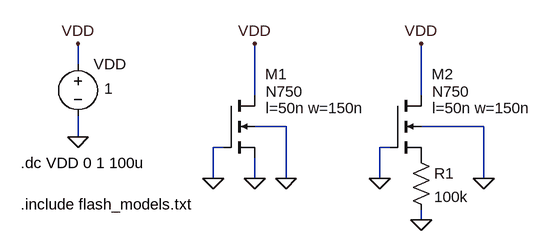
[diagram p0: schematic Flash_cells_parasitic_R.asc]
Flash_cells_parasitic_R.asc, the LTspice schematic file:
Version 4
SHEET 1 2620 680
WIRE 432 -1520 432 -1552
WIRE 704 -1472 704 -1552
WIRE 960 -1472 960 -1552
WIRE 752 -1424 704 -1424
WIRE 1056 -1424 960 -1424
WIRE 432 -1408 432 -1440
WIRE 656 -1392 640 -1392
WIRE 912 -1392 896 -1392
WIRE 640 -1344 640 -1392
WIRE 704 -1344 704 -1376
WIRE 752 -1344 752 -1424
WIRE 896 -1344 896 -1392
WIRE 1056 -1344 1056 -1424
WIRE 960 -1280 960 -1296
FLAG 432 -1408 0
FLAG 432 -1552 VDD
FLAG 704 -1344 0
FLAG 640 -1344 0
FLAG 752 -1344 0
FLAG 704 -1552 VDD
FLAG 960 -1280 0
FLAG 896 -1344 0
FLAG 1056 -1344 0
FLAG 960 -1552 VDD
SYMBOL voltage 432 -1536 R0
WINDOW 123 0 0 Left 0
WINDOW 39 0 0 Left 0
WINDOW 3 40 53 Left 0
SYMATTR Value 1
SYMATTR InstName VDD
SYMBOL nmos4 656 -1472 R0
WINDOW 0 64 -33 Left 0
WINDOW 3 65 -6 Left 0
WINDOW 123 65 19 Left 0
SYMATTR InstName M1
SYMATTR Value N750
SYMATTR Value2 l=50n w=150n
SYMBOL nmos4 912 -1472 R0
WINDOW 0 64 -33 Left 0
WINDOW 3 65 -6 Left 0
WINDOW 123 65 19 Left 0
SYMATTR InstName M2
SYMATTR Value N750
SYMATTR Value2 l=50n w=150n
SYMBOL res 944 -1392 R0
SYMATTR InstName R1
SYMATTR Value 100k
TEXT 344 -1304 Left 0 !.include flash_models.txt
TEXT 344 -1368 Left 0 !.dc VDD 0 1 100u

The netlist it stands for:
* Flash_cells_parasitic_R.asc
VDD VDD 0 1
M1 VDD 0 0 0 N750 l=50n w=150n
M2 VDD 0 P001 0 N750 l=50n w=150n
R1 P001 0 100k
.model NMOS NMOS
.model PMOS PMOS
.lib standard.mos
.include flash_models.txt
.dc VDD 0 1 100u
.backanno
.end